# Altium project Lab 4.PrjPCB
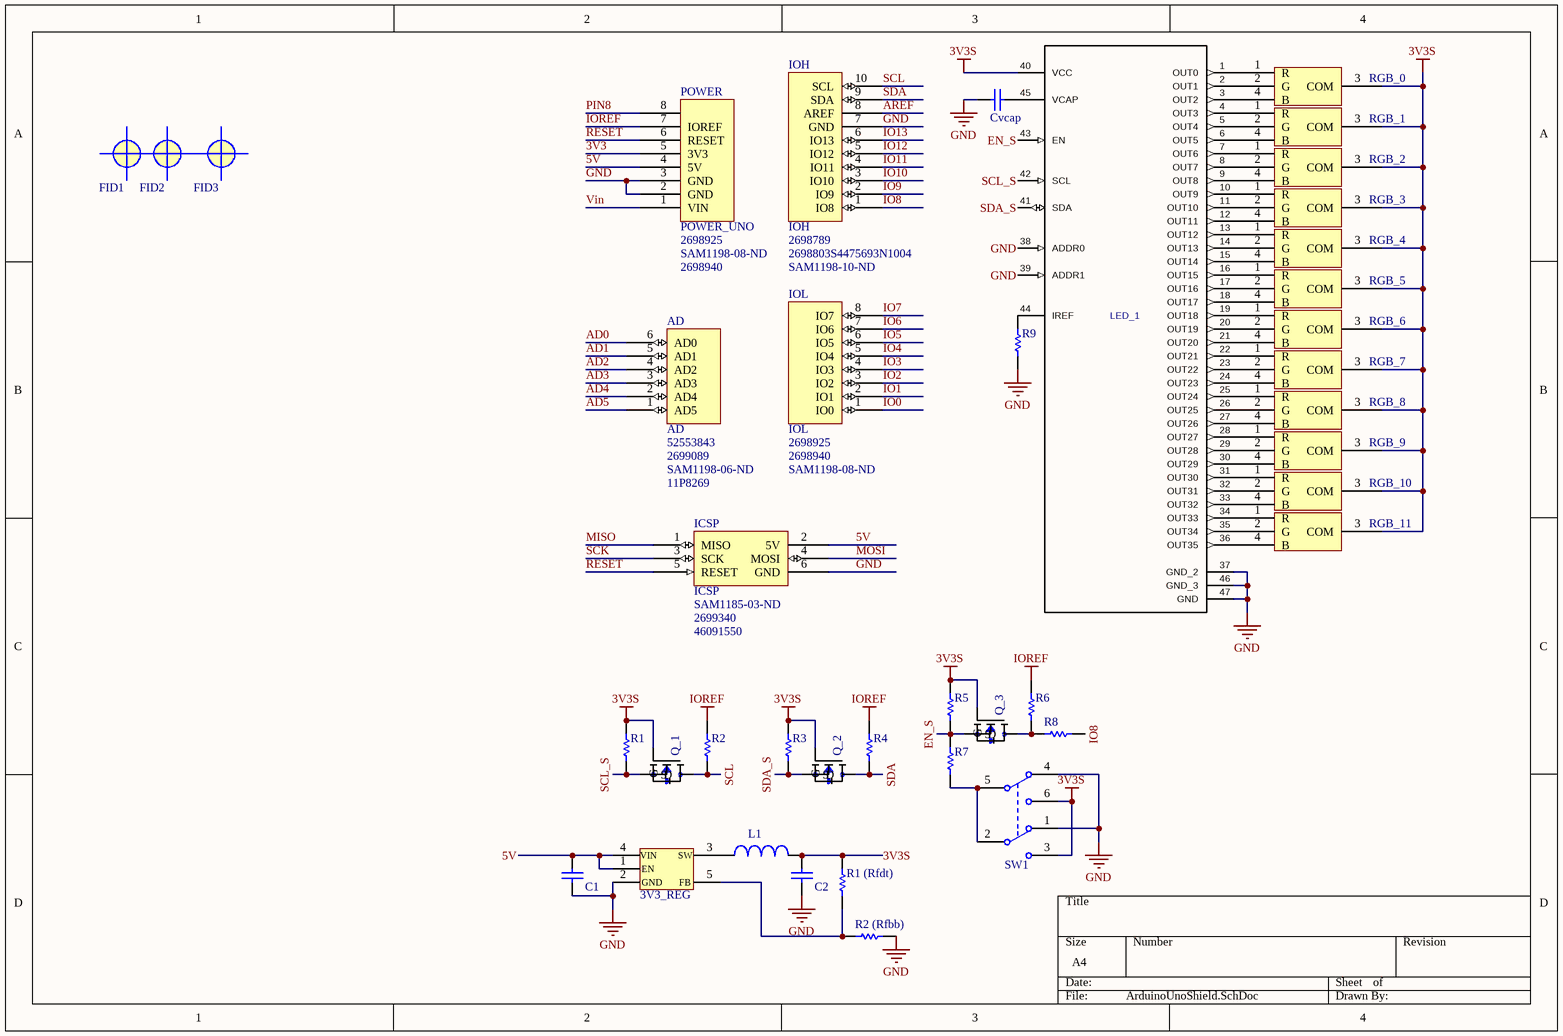
[diagram p0: ArduinoUnoShield.SchDoc]
1 sheet, 41 parts. Net scope: global (net labels, ports and power ports of the same name join across sheets).
Board file: ArduinoUnoShield.PcbDoc

## Sheet ArduinoUnoShield.SchDoc
size A4

### Parts
3V3_REG  TLV62568DBVR  [*SOT95P280X145-5N]  (value not drawn)
AD  AD  Supplier Part Number 1: 52553843  Supplier Part Number 2: 2699089  Supplier Part Number 3: SAM1198-06-ND  Supplier Part Number 4: 11P8269  [Header 6x1 8.5mm]
C1  4.7uF, 10%  [0805]  (value not drawn)
C2  1uF, 5%  [0805_CAP_HD]  (value not drawn)
Cvcap  22uF, 20%  [0805_CAP_HD]  (value not drawn)
FID1  FIDUCIAL  [FIDUCIAL (50MIL ROUND)]  (value not drawn)
FID2  FIDUCIAL  [FIDUCIAL (50MIL ROUND)]  (value not drawn)
FID3  FIDUCIAL  [FIDUCIAL (50MIL ROUND)]  (value not drawn)
ICSP  ICSP  Supplier Part Number 1: SAM1185-03-ND  Supplier Part Number 2: 2699340  Supplier Part Number 3: 46091550  [ICSP]
IOH  IOH  Supplier Part Number 1: 2698789  Supplier Part Number 2: 2698803S4475693N1004  Supplier Part Number 3: SAM1198-10-ND  [Header 10x1 8.5mm]
IOL  IOL  Supplier Part Number 1: 2698925  Supplier Part Number 2: 2698940  Supplier Part Number 3: SAM1198-08-ND  [Header 8x1 8.5mm]
L1  SDR0403-2R2ML  [*SDR0403]  (value not drawn)
LED_1  LP5036RJVR  [RJV0046A]  (value not drawn)
POWER  POWER_UNO  Supplier Part Number 1: 2698925  Supplier Part Number 2: SAM1198-08-ND  Supplier Part Number 3: 2698940  [Header 8x1 8.5mm v2]
Q_1  BSS138  [*BSS138_BSS138(Primary)]  (value not drawn)
Q_2  BSS138  [*BSS138_BSS138(Primary)]  (value not drawn)
Q_3  BSS138  [*BSS138_BSS138(Primary)]  (value not drawn)
R1  4.7K, 5%  [0805]  (value not drawn)
R1_(Rfdt)  R-NP  [0805_RES_HD]  (value not drawn)  (no BOM)
R2  4.7K, 5%  [0805]  (value not drawn)
R2_(Rfbb)  R-NP  [0805_RES_HD]  (value not drawn)  (no BOM)
R3  4.7K, 5%  [0805]  (value not drawn)
R4  4.7K, 5%  [0805]  (value not drawn)
R5  4.7K, 5%  [0805]  (value not drawn)
R6  4.7K, 5%  [0805]  (value not drawn)
R7  0, 5%  [0603_RES_HD]  (value not drawn)
R8  0, 5%  [0603_RES_HD]  (value not drawn)
R9  4.7K, 5%  [0805]  (value not drawn)
RGB_0  RGB LED  [PCBComponent_1]  (value not drawn)
RGB_1  RGB LED  [PCBComponent_1]  (value not drawn)
RGB_2  RGB LED  [PCBComponent_1]  (value not drawn)
RGB_3  RGB LED  [PCBComponent_1]  (value not drawn)
RGB_4  RGB LED  [PCBComponent_1]  (value not drawn)
RGB_5  RGB LED  [PCBComponent_1]  (value not drawn)
RGB_6  RGB LED  [PCBComponent_1]  (value not drawn)
RGB_7  RGB LED  [PCBComponent_1]  (value not drawn)
RGB_8  RGB LED  [PCBComponent_1]  (value not drawn)
RGB_9  RGB LED  [PCBComponent_1]  (value not drawn)
RGB_10  RGB LED  [PCBComponent_1]  (value not drawn)
RGB_11  RGB LED  [PCBComponent_1]  (value not drawn)
SW1  JS202011SCQN  [JS202011SCQN]  (value not drawn)

### Nets
3V3S: C2.2 L1.2 LED_1.40(VCC) Q_1.G Q_2.G Q_3.G R1.2 R1_(Rfdt).2 R3.2 R5.2 RGB_0.3(COM) RGB_1.3(COM) RGB_2.3(COM) RGB_3.3(COM) RGB_4.3(COM) RGB_5.3(COM) RGB_6.3(COM) RGB_7.3(COM) RGB_8.3(COM) RGB_9.3(COM) RGB_10.3(COM) RGB_11.3(COM) SW1.3(NO2) SW1.6(NC1)
GND: 3V3_REG.2 C1.1 C2.1 Cvcap.2 ICSP.6(GND) IOH.7(GND) LED_1.37(GND_2) LED_1.38(ADDR0) LED_1.39(ADDR1) LED_1.46(GND_3) LED_1.47(GND) POWER.2(GND) POWER.3(GND) R2_(Rfbb).2 R9.1 SW1.1(NC2) SW1.4(NO1)
IOREF: POWER.7(IOREF) R2.2 R4.2 R6.2
3V3: POWER.5(3V3)
5V: 3V3_REG.1 3V3_REG.4 C1.2 ICSP.2(5V) POWER.4(5V)
AD0: AD.6(AD0)
AD1: AD.5(AD1)
AD2: AD.4(AD2)
AD3: AD.3(AD3)
AD4: AD.2(AD4)
AD5: AD.1(AD5)
AREF: IOH.8(AREF)
EN_S: LED_1.43(EN) Q_3.S R5.1 R7.2
IO0: IOL.1(IO0)
IO1: IOL.2(IO1)
IO2: IOL.3(IO2)
IO3: IOL.4(IO3)
IO4: IOL.5(IO4)
IO5: IOL.6(IO5)
IO6: IOL.7(IO6)
IO7: IOL.8(IO7)
IO8: IOH.1(IO8) R8.1
IO9: IOH.2(IO9)
IO10: IOH.3(IO10)
IO11: IOH.4(IO11)
IO12: IOH.5(IO12)
IO13: IOH.6(IO13)
MISO: ICSP.1(MISO)
MOSI: ICSP.4(MOSI)
PIN8: POWER.8
RESET: ICSP.5(RESET) POWER.6(RESET)
SCK: ICSP.3(SCK)
SCL: IOH.10(SCL) Q_1.D R2.1
SCL_S: LED_1.42(SCL) Q_1.S R1.1
SDA: IOH.9(SDA) Q_2.D R4.1
SDA_S: LED_1.41(SDA) Q_2.S R3.1
Vin: POWER.1(VIN)
Net3V3_REG_3: 3V3_REG.3 L1.1
Net3V3_REG_5: 3V3_REG.5 R1_(Rfdt).1 R2_(Rfbb).1
NetCvcap_1: Cvcap.1 LED_1.45(VCAP)
NetLED_1_1: LED_1.1(OUT0) RGB_0.1(R)
NetLED_1_2: LED_1.2(OUT1) RGB_0.2(G)
NetLED_1_3: LED_1.3(OUT2) RGB_0.4(B)
NetLED_1_4: LED_1.4(OUT3) RGB_1.1(R)
NetLED_1_5: LED_1.5(OUT4) RGB_1.2(G)
NetLED_1_6: LED_1.6(OUT5) RGB_1.4(B)
NetLED_1_7: LED_1.7(OUT6) RGB_2.1(R)
NetLED_1_8: LED_1.8(OUT7) RGB_2.2(G)
NetLED_1_9: LED_1.9(OUT8) RGB_2.4(B)
NetLED_1_10: LED_1.10(OUT9) RGB_3.1(R)
NetLED_1_11: LED_1.11(OUT10) RGB_3.2(G)
NetLED_1_12: LED_1.12(OUT11) RGB_3.4(B)
NetLED_1_13: LED_1.13(OUT12) RGB_4.1(R)
NetLED_1_14: LED_1.14(OUT13) RGB_4.2(G)
NetLED_1_15: LED_1.15(OUT14) RGB_4.4(B)
NetLED_1_16: LED_1.16(OUT15) RGB_5.1(R)
NetLED_1_17: LED_1.17(OUT16) RGB_5.2(G)
NetLED_1_18: LED_1.18(OUT17) RGB_5.4(B)
NetLED_1_19: LED_1.19(OUT18) RGB_6.1(R)
NetLED_1_20: LED_1.20(OUT19) RGB_6.2(G)
NetLED_1_21: LED_1.21(OUT20) RGB_6.4(B)
NetLED_1_22: LED_1.22(OUT21) RGB_7.1(R)
NetLED_1_23: LED_1.23(OUT22) RGB_7.2(G)
NetLED_1_24: LED_1.24(OUT23) RGB_7.4(B)
NetLED_1_25: LED_1.25(OUT24) RGB_8.1(R)
NetLED_1_26: LED_1.26(OUT25) RGB_8.2(G)
NetLED_1_27: LED_1.27(OUT26) RGB_8.4(B)
NetLED_1_28: LED_1.28(OUT27) RGB_9.1(R)
NetLED_1_29: LED_1.29(OUT28) RGB_9.2(G)
NetLED_1_30: LED_1.30(OUT29) RGB_9.4(B)
NetLED_1_31: LED_1.31(OUT30) RGB_10.1(R)
NetLED_1_32: LED_1.32(OUT31) RGB_10.2(G)
NetLED_1_33: LED_1.33(OUT32) RGB_10.4(B)
NetLED_1_34: LED_1.34(OUT33) RGB_11.1(R)
NetLED_1_35: LED_1.35(OUT34) RGB_11.2(G)
NetLED_1_36: LED_1.36(OUT35) RGB_11.4(B)
NetLED_1_44: LED_1.44(IREF) R9.2
NetQ_3_D: Q_3.D R6.1 R8.2
NetR7_1: R7.1 SW1.2(COMMON1) SW1.5(COMMON2)

### Notes on the sheet
- (in symbol TLV62568DBVR) VIN; SW; EN; GND; FB

### Library data of the parts
C1 = CL21A475KPFNNNE: 4.7uF, 10%, 10V; Manufacturer 1: Samsung; GFUPartNo: CL21A475KPFNNNE; Manufacturer Part Number 1: CL21A475KPFNNNE; Part Type: SMT; PackageReference: 0805; Supplier 1: Digi-Key; Supplier Part Number 1: 1276-1259-1-ND
C2 = 08056D226MAT2A: 1uF, 5%, 6.3V; Manufacturer 1: AVX; GFUPartNo: 08056D226MAT2A; Manufacturer Part Number 1: 08056D226MAT2A; Part Type: SMT; PackageReference: 0805; Supplier 1: Digi-Key; Supplier Part Number 1: 478-3647-1-ND
Cvcap = 08056D226MAT2A: 22uF, 20%, 6.3V; Manufacturer 1: AVX; GFUPartNo: 08056D226MAT2A; Manufacturer Part Number 1: 08056D226MAT2A; Part Type: SMT; PackageReference: 0805; Supplier 1: Digi-Key; Supplier Part Number 1: 478-3647-1-ND
FID1-FID3 = FIDUCIAL (50MIL ROUND): GFUPartNo: FIDUCIAL (50MIL ROUND)
L1 = SDR0403-2R2ML: 2.2µH Unshielded Wirewound Inductor 2.6A 47mOhm Max Nonstandard; MF: Bourns; Availability: Unavailable; Price: None; MP: SDR0403-2R2ML; Package: Nonstandard Bourns; Value: *; digikey_Link: https://www.digikey.com/product-detail/en/bourns-inc/SDR0403-2R2ML/SDR0403-2R2MLCT-ND/2127089
LED_1 = LP5036RJVR: Manufacturer: Texas Instruments; PartNumber: LP5036RJVR
Q_1-Q_3 = BSS138: N-Channel 50V 220mA _Ta_ 360mW _Ta_ Surface Mount Die; MF: MICROSS/On Semiconductor; SnapEDA_Link: https://www.snapeda.com/parts/BSS138/MICROSS/On%20Semiconductor/view-part/215/?ref=snap; Price: None; Availability: Unavailable; MP: BSS138; Package: SOT-23 Fairchild Semiconductor; Value: *
R1-R6 R9 = RMCF0805JT4K70: RES 4.7K OHM 1/8W 5% 0805 SMD; Manufacturer 1: Stackpole; GFUPartNo: RMCF0805JT4K70; Manufacturer Part Number 1: RMCF0805JT4K70; Part Type: SMT; Supplier 1: Digi-Key; Supplier Part Number 1: RMCF0805JT4K70CT-ND
R1_(Rfdt) R2_(Rfbb) = R-NP 0805: NO PLACE RESISTOR; GFUPartNo: R-NP 0805
R7 R8 = CRCW06030000Z0EA: RES 0.0 OHM 1/10W 5% 0603 SMD; Manufacturer 1: Vishay; GFUPartNo: CRCW06030000Z0EA; Manufacturer Part Number 1: CRCW06030000Z0EA; Part Type: SMT; Supplier 1: Digi-Key; Supplier Part Number 1: 541-0.0GCT-ND
SW1 = JS202011SCQN: SWITCH SLIDE DPDT 6VDC 0.3A SMT; Manufacturer 1: C&K Components; GFUPartNo: JS202011SCQN; Manufacturer Part Number 1: JS202011SCQN; Part Type: SMT; Supplier 1: Digi-Key; Supplier Part Number 1: 401-2002-1-ND
AD = AD: Supplier 1: Arrow; Supplier 2: Arrow; Supplier 3: Digi-Key; Supplier 4: Newark
ICSP = ICSP: Supplier 1: Digi-Key; Supplier 2: Arrow; Supplier 3: Arrow
IOH = IOH: Supplier 1: Arrow; Supplier 2: Arrow; Supplier 3: Digi-Key
IOL = IOL: Supplier 1: Arrow; Supplier 2: Arrow; Supplier 3: Digi-Key
POWER = POWER_UNO: Supplier 1: Arrow; Supplier 2: Digi-Key; Supplier 3: Arrow